# Altium schematic sheet EPM240T100C5N_2.SchDoc
size 420 x 297 mm; SheetNumber: 2; SheetTotal: 2
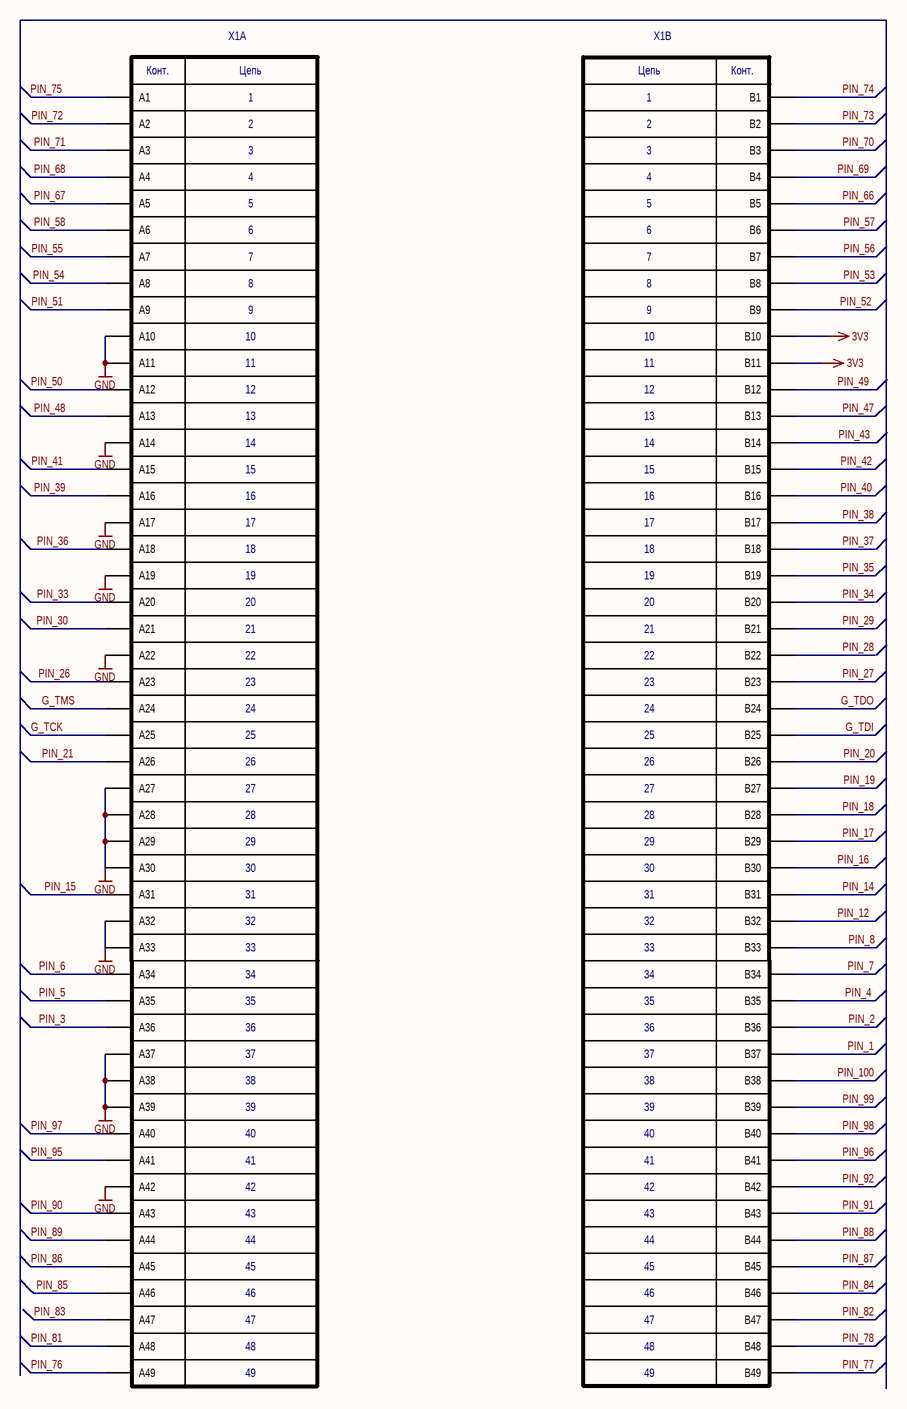
[diagram p0: EPM240T100C5N_2.SchDoc]

## Parts
X1  KONT_POLE_MEZ  [3113-112t_otv]  (value not drawn)  (parts A,B of 2)

## Nets
3V3: X1.B10 X1.B11
GND: X1.A10 X1.A11 X1.A14 X1.A17 X1.A19 X1.A22 X1.A27 X1.A28 X1.A29 X1.A30 X1.A32 X1.A33 X1.A37 X1.A38 X1.A39 X1.A42
G_TCK: X1.A25
G_TDI: X1.B25
G_TDO: X1.B24
G_TMS: X1.A24
PIN_1: X1.B37
PIN_2: X1.B36
PIN_3: X1.A36
PIN_4: X1.B35
PIN_5: X1.A35
PIN_6: X1.A34
PIN_7: X1.B34
PIN_8: X1.B33
PIN_12: X1.B32
PIN_14: X1.B31
PIN_15: X1.A31
PIN_16: X1.B30
PIN_17: X1.B29
PIN_18: X1.B28
PIN_19: X1.B27
PIN_20: X1.B26
PIN_21: X1.A26
PIN_26: X1.A23
PIN_27: X1.B23
PIN_28: X1.B22
PIN_29: X1.B21
PIN_30: X1.A21
PIN_33: X1.A20
PIN_34: X1.B20
PIN_35: X1.B19
PIN_36: X1.A18
PIN_37: X1.B18
PIN_38: X1.B17
PIN_39: X1.A16
PIN_40: X1.B16
PIN_41: X1.A15
PIN_42: X1.B15
PIN_43: X1.B14
PIN_47: X1.B13
PIN_48: X1.A13
PIN_49: X1.B12
PIN_50: X1.A12
PIN_51: X1.A9
PIN_52: X1.B9
PIN_53: X1.B8
PIN_54: X1.A8
PIN_55: X1.A7
PIN_56: X1.B7
PIN_57: X1.B6
PIN_58: X1.A6
PIN_66: X1.B5
PIN_67: X1.A5
PIN_68: X1.A4
PIN_69: X1.B4
PIN_70: X1.B3
PIN_71: X1.A3
PIN_72: X1.A2
PIN_73: X1.B2
PIN_74: X1.B1
PIN_75: X1.A1
PIN_76: X1.A49
PIN_77: X1.B49
PIN_78: X1.B48
PIN_81: X1.A48
PIN_82: X1.B47
PIN_83: X1.A47
PIN_84: X1.B46
PIN_85: X1.A46
PIN_86: X1.A45
PIN_87: X1.B45
PIN_88: X1.B44
PIN_89: X1.A44
PIN_90: X1.A43
PIN_91: X1.B43
PIN_92: X1.B42
PIN_95: X1.A41
PIN_96: X1.B41
PIN_97: X1.A40
PIN_98: X1.B40
PIN_99: X1.B39
PIN_100: X1.B38

## Notes on the sheet
- Подп. и дата
- Инв.№ дубл.
- Взам. инв. №
- Инв № подл.
- Изм.
- Лист
- № докум.
- Подп.
- Дата
- Копировал
- Формат А3
- (in symbol 3113-112T, part A) Конт.; Цепь; 1; 2; 3; 4; 5; 6; 7; 8; 9; 10; 11; 12; 13; 14; 15; 16; 17; 18; 19; 20; 21; 22; 23; 24; 25; 26; 27; 28; 29; 30; 31; 32; 33; 34; 35; 36; 37; 38; 39; 40; 41; 42; 43; 44; 45; 46; 47; 48; 49
- (in symbol 3113-112T, part B) Цепь; Конт.; 1; 2; 3; 4; 5; 6; 7; 8; 9; 10; 11; 12; 13; 14; 15; 16; 17; 18; 19; 20; 21; 22; 23; 24; 25; 26; 27; 28; 29; 30; 31; 32; 33; 34; 35; 36; 37; 38; 39; 40; 41; 42; 43; 44; 45; 46; 47; 48; 49

## Library data of the parts
X1 = 3113-112T